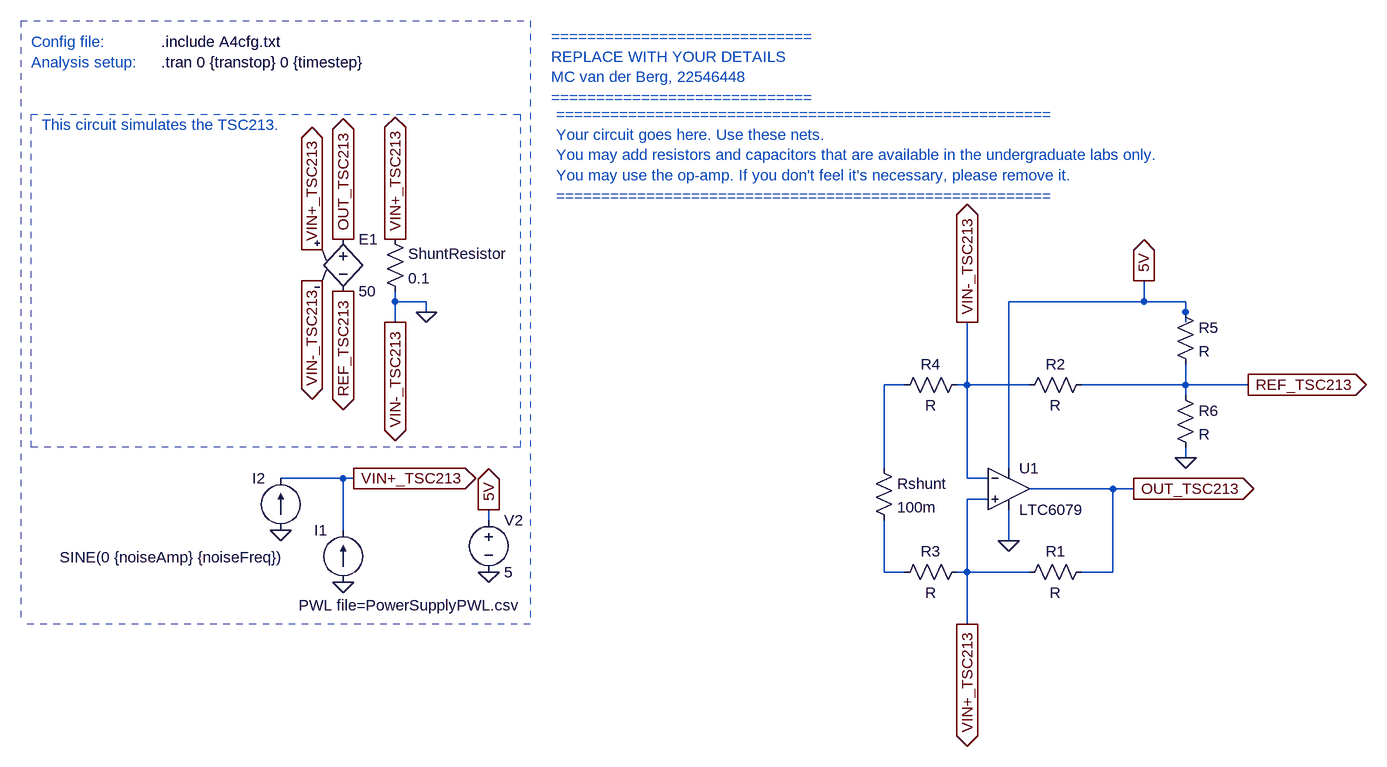
[diagram p0: schematic E344_XXXXXXXX_A4.asc]
E344_XXXXXXXX_A4.asc, the LTspice schematic file:
Version 4
SHEET 1 1824 680
WIRE -1792 -992 -1792 -1008
WIRE -1744 -992 -1792 -992
WIRE -640 -992 -640 -1024
WIRE -640 -992 -848 -992
WIRE -576 -992 -640 -992
WIRE -1744 -976 -1744 -992
WIRE -576 -976 -576 -992
WIRE -1792 -960 -1792 -992
WIRE -576 -960 -576 -976
WIRE -1008 -864 -1040 -864
WIRE -912 -864 -912 -960
WIRE -912 -864 -928 -864
WIRE -816 -864 -912 -864
WIRE -576 -864 -576 -896
WIRE -576 -864 -736 -864
WIRE -480 -864 -576 -864
WIRE -576 -848 -576 -864
WIRE -576 -752 -576 -768
WIRE -1040 -736 -1040 -864
WIRE -848 -736 -848 -992
WIRE -1872 -720 -1968 -720
WIRE -1856 -720 -1872 -720
WIRE -912 -720 -912 -864
WIRE -880 -720 -912 -720
WIRE -688 -704 -816 -704
WIRE -656 -704 -688 -704
WIRE -880 -688 -912 -688
WIRE -1648 -656 -1648 -672
WIRE -1872 -640 -1872 -720
WIRE -848 -624 -848 -672
WIRE -1040 -576 -1040 -656
WIRE -1008 -576 -1040 -576
WIRE -912 -576 -912 -688
WIRE -912 -576 -928 -576
WIRE -816 -576 -912 -576
WIRE -688 -576 -688 -704
WIRE -688 -576 -736 -576
WIRE -912 -496 -912 -576
FLAG -1648 -672 5V
IOPIN -1648 -672 Out
FLAG -1648 -576 0
FLAG -656 -704 OUT_TSC213
IOPIN -656 -704 Out
FLAG -912 -960 VIN-_TSC213
IOPIN -912 -960 Out
FLAG -912 -496 VIN+_TSC213
IOPIN -912 -496 Out
FLAG -1872 -560 0
FLAG -1792 -1088 VIN+_TSC213
IOPIN -1792 -1088 Out
FLAG -1792 -960 VIN-_TSC213
IOPIN -1792 -960 Out
FLAG -1920 -1024 VIN-_TSC213
IOPIN -1920 -1024 Out
FLAG -1920 -1072 VIN+_TSC213
IOPIN -1920 -1072 Out
FLAG -1872 -1008 REF_TSC213
IOPIN -1872 -1008 Out
FLAG -1872 -1088 OUT_TSC213
IOPIN -1872 -1088 Out
FLAG -1856 -720 VIN+_TSC213
IOPIN -1856 -720 Out
FLAG -1968 -640 0
FLAG -640 -1024 5V
IOPIN -640 -1024 Out
FLAG -848 -624 0
FLAG -1744 -976 0
FLAG -480 -864 REF_TSC213
IOPIN -480 -864 Out
FLAG -576 -752 0
SYMBOL e -1872 -1104 R0
SYMATTR InstName E1
SYMATTR Value 50
SYMBOL current -1872 -560 R180
WINDOW 0 24 80 Left 2
WINDOW 3 -271 -35 Left 2
WINDOW 123 0 0 Left 0
WINDOW 39 0 0 Left 0
SYMATTR InstName I1
SYMATTR Value PWL file=PowerSupplyPWL.csv
SYMBOL res -1808 -1104 R0
WINDOW 0 36 38 Left 2
SYMATTR InstName ShuntResistor
SYMATTR Value 0.1
SYMBOL voltage -1648 -672 R0
WINDOW 123 0 0 Left 0
WINDOW 39 0 0 Left 0
SYMATTR InstName V2
SYMATTR Value 5
SYMBOL current -1968 -640 R180
WINDOW 0 24 80 Left 2
WINDOW 3 -7 -41 Left 2
WINDOW 123 0 0 Left 0
WINDOW 39 0 0 Left 0
SYMATTR InstName I2
SYMATTR Value SINE(0 {noiseAmp} {noiseFreq})
SYMBOL OpAmps\\LTC6079 -848 -704 R0
SYMATTR InstName U1
SYMBOL res -1056 -752 R0
SYMATTR InstName Rshunt
SYMATTR Value 100m
SYMBOL res -912 -880 R90
WINDOW 0 0 56 VBottom 2
WINDOW 3 32 56 VTop 2
SYMATTR InstName R4
SYMBOL res -912 -592 R90
WINDOW 0 0 56 VBottom 2
WINDOW 3 32 56 VTop 2
SYMATTR InstName R3
SYMBOL res -720 -880 R90
WINDOW 0 0 56 VBottom 2
WINDOW 3 32 56 VTop 2
SYMATTR InstName R2
SYMBOL res -720 -592 R90
WINDOW 0 0 56 VBottom 2
WINDOW 3 32 56 VTop 2
SYMATTR InstName R1
SYMBOL res -592 -992 R0
SYMATTR InstName R5
SYMBOL res -592 -864 R0
SYMATTR InstName R6
TEXT -2152 -1360 Left 2 !.tran 0 {transtop} 0 {timestep}
TEXT -2152 -1392 Left 2 !.include A4cfg.txt
TEXT -2352 -1392 Left 2 ;Config file:
TEXT -2352 -1360 Left 2 ;Analysis setup:
TEXT -1552 -1400 Left 2 ;=============================\nREPLACE WITH YOUR DETAILS\nMC van der Berg, 22546448\n=============================
TEXT -1544 -1280 Left 2 ;=======================================================\nYour circuit goes here. Use these nets.\nYou may add resistors and capacitors that are available in the undergraduate labs only.\nYou may use the op-amp. If you don't feel it's necessary, please remove it.\n=======================================================
TEXT -2336 -1264 Left 2 ;This circuit simulates the TSC213.
LINE Normal -1584 -1424 -1584 -496 2
LINE Normal -2368 -1424 -1584 -1424 2
LINE Normal -1584 -496 -2368 -496 2
LINE Normal -1584 -512 -1584 -512 2
LINE Normal -2368 -1424 -2368 -496 2
RECTANGLE Normal -2352 -1280 -1600 -768 2

The netlist it stands for:
* E344_XXXXXXXX_A4.asc
E1 OUT_TSC213 REF_TSC213 VIN+_TSC213 0 50
I1 0 VIN+_TSC213 PWL file=PowerSupplyPWL.csv
R§ShuntResistor VIN+_TSC213 0 0.1
V2 5V 0 5
I2 0 VIN+_TSC213 SINE(0 {noiseAmp} {noiseFreq})
XU1 VIN+_TSC213 0 5V 0 OUT_TSC213 LTC6078  ; LTC6079, pins In+ In- V+ V- OUT
Rshunt N001 N002 100m
R4 0 N001 R
R3 VIN+_TSC213 N002 R
R2 REF_TSC213 0 R
R1 OUT_TSC213 VIN+_TSC213 R
R5 5V REF_TSC213 R
R6 REF_TSC213 0 R
.tran 0 {transtop} 0 {timestep}
.include A4cfg.txt
* Config file:
* Analysis setup:
* =============================
* REPLACE WITH YOUR DETAILS
* MC van der Berg, 22546448
* =============================
* =======================================================
* Your circuit goes here. Use these nets.
* You may add resistors and capacitors that are available in the undergraduate labs only.
* You may use the op-amp. If you don't feel it's necessary, please remove it.
* =======================================================
* This circuit simulates the TSC213.
.lib LTC5.lib
.backanno
.end